# Altium schematic sheet 2_BLOCK_DIAGRAM.SchDoc
size 420 x 297 mm; SheetNumber: 2; SheetTotal: 7
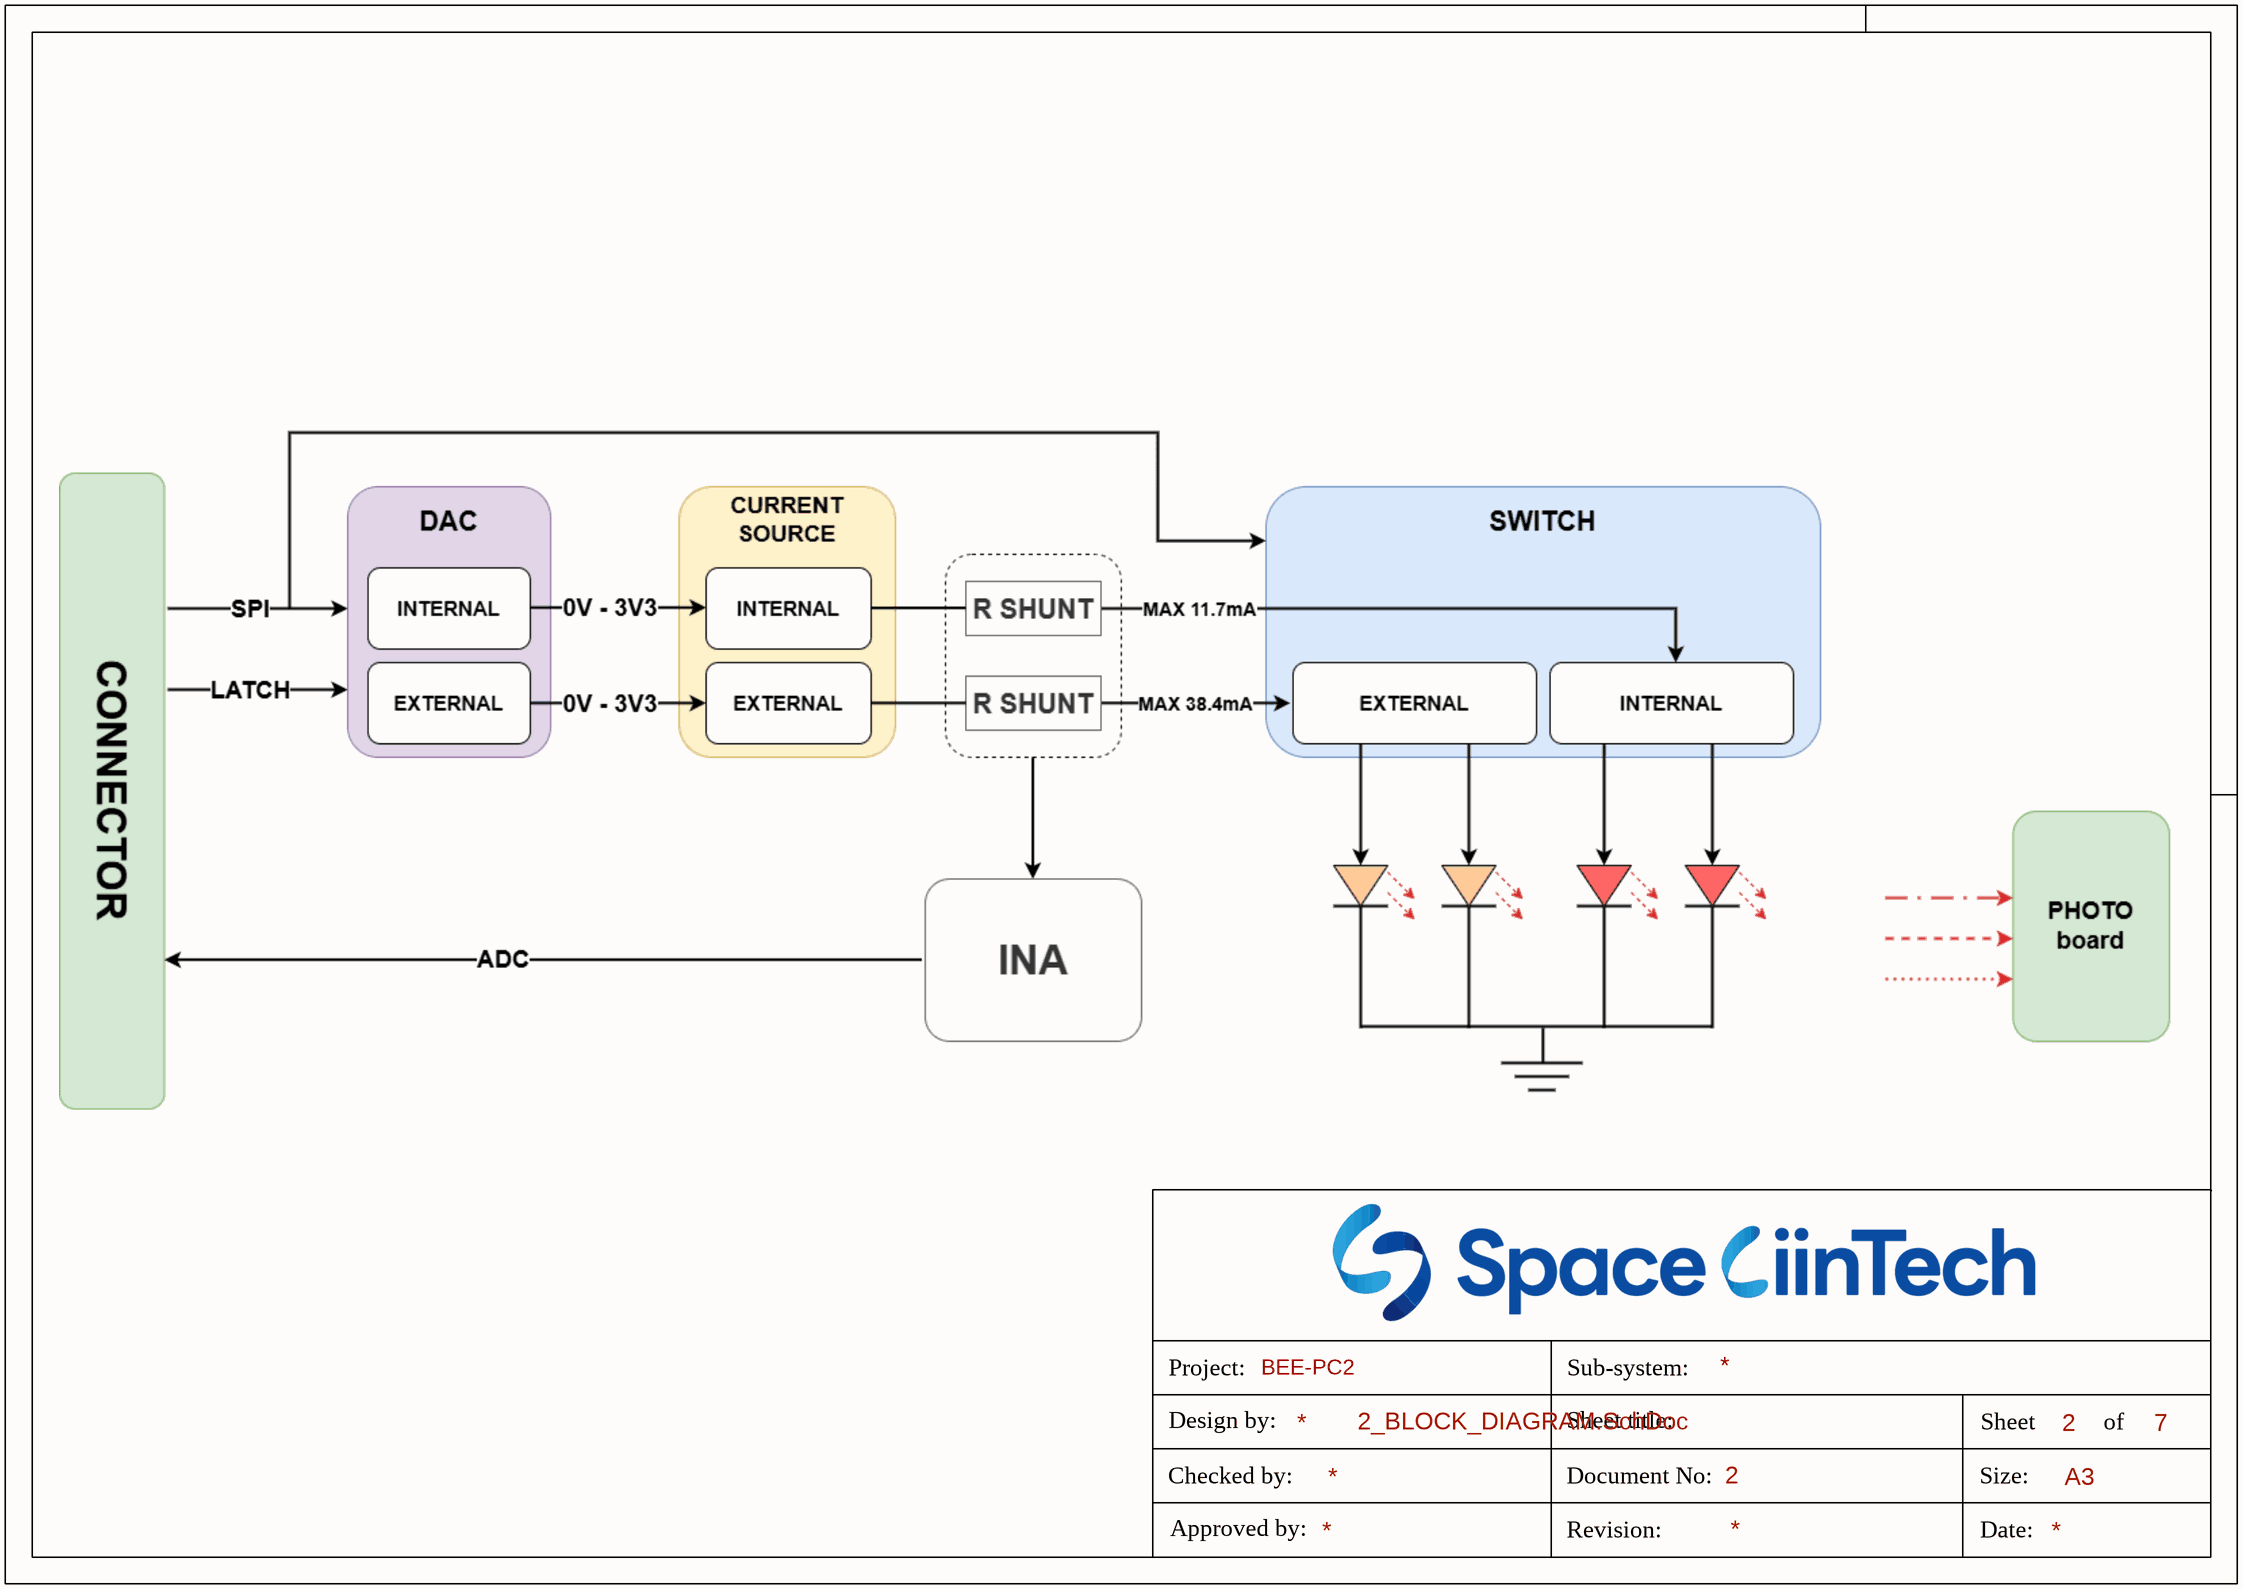
[diagram p0: 2_BLOCK_DIAGRAM.SchDoc]

## Notes on the sheet
- BEE-PC2
- Project:
- Sub-system:
- Design by:
- Sheet title:
- Sheet
- A3
- of
- Checked by:
- Approved by:
- Revision:
- Document No:
- Size:
- Date: